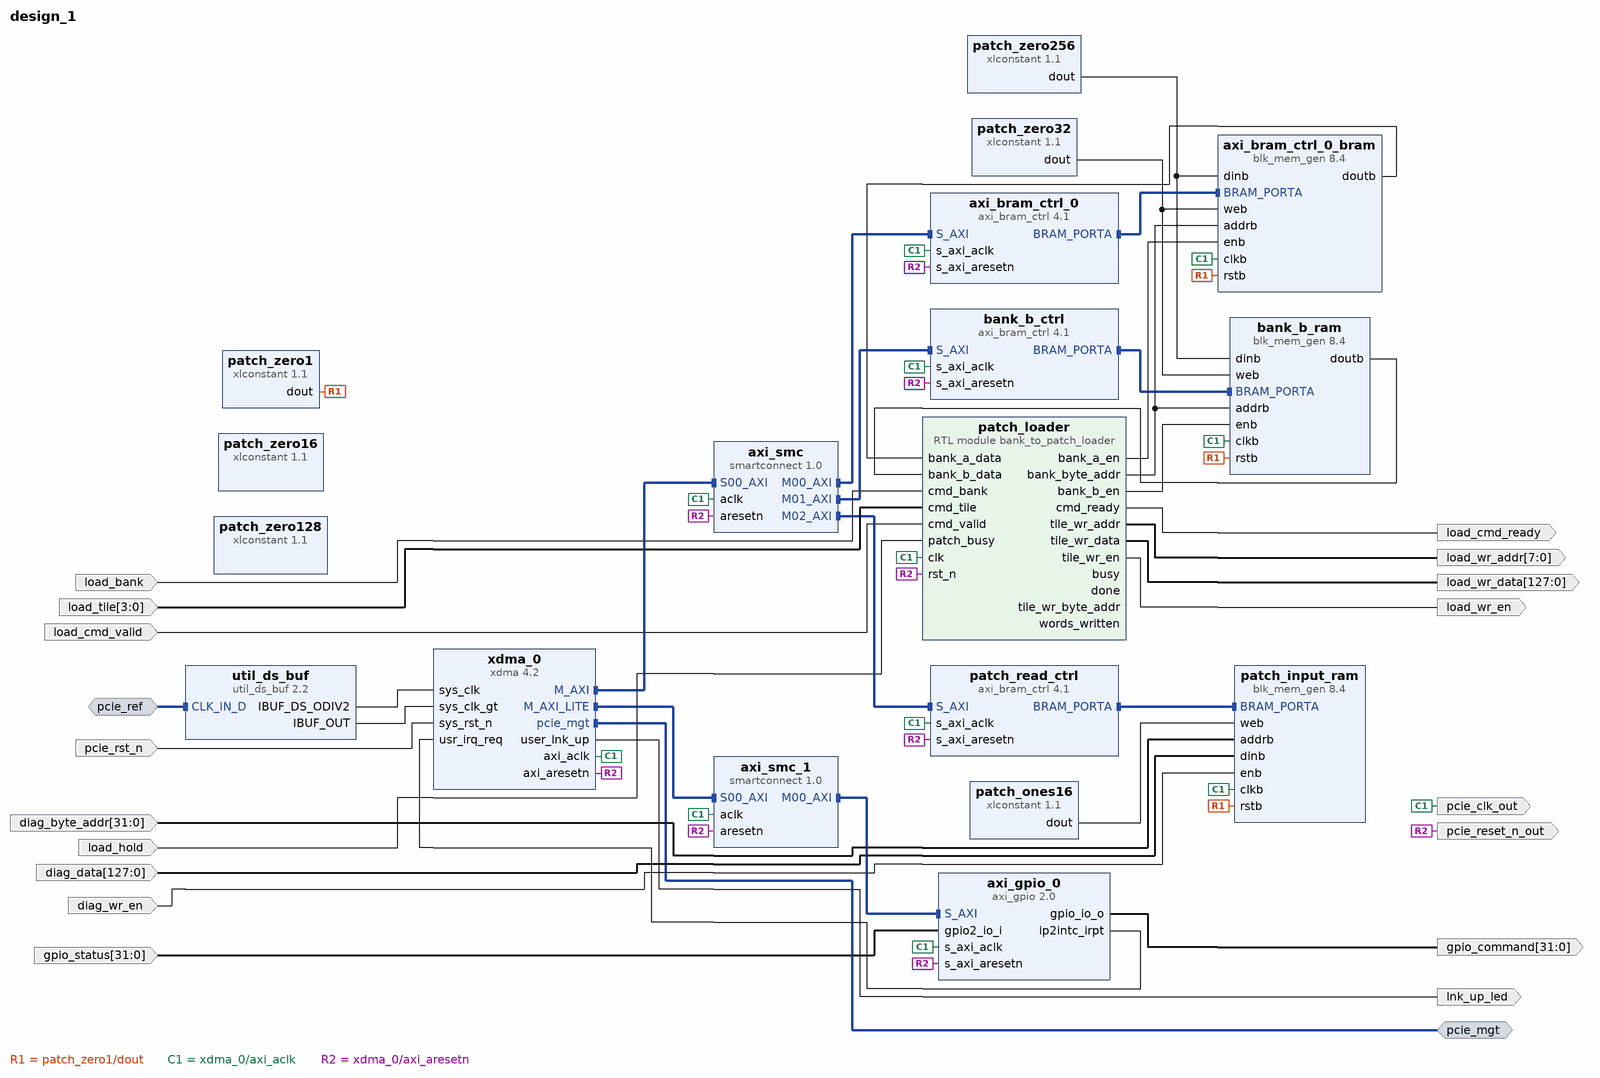
[diagram p0: block diagram of the top level]
# Vivado block design design_1, xcku060-ffva1156-2-i, Vivado 2025.2
create_bd_design design_1

create_bd_intf_port -mode Master -vlnv xilinx.com:interface:pcie_7x_mgt_rtl:1.0 pcie_mgt
create_bd_intf_port -mode Slave -vlnv xilinx.com:interface:diff_clock_rtl:1.0 pcie_ref
set_property -dict {CONFIG.FREQ_HZ 100000000} [get_bd_intf_ports pcie_ref]
create_bd_port -dir I -type rst pcie_rst_n
set_property -dict {CONFIG.POLARITY ACTIVE_LOW} [get_bd_ports pcie_rst_n]
create_bd_port -dir O lnk_up_led
create_bd_port -dir O pcie_clk_out
create_bd_port -dir O pcie_reset_n_out
create_bd_port -dir O -from 31 -to 0 gpio_command
create_bd_port -dir I -from 31 -to 0 gpio_status
create_bd_port -dir I load_cmd_valid
create_bd_port -dir O load_cmd_ready
create_bd_port -dir I load_bank
create_bd_port -dir I -from 3 -to 0 load_tile
create_bd_port -dir I load_hold
create_bd_port -dir O load_wr_en
create_bd_port -dir O -from 7 -to 0 load_wr_addr
create_bd_port -dir O -from 127 -to 0 load_wr_data
create_bd_port -dir I -from 31 -to 0 diag_byte_addr
create_bd_port -dir I -from 127 -to 0 diag_data
create_bd_port -dir I diag_wr_en

create_bd_cell -type ip -vlnv xilinx.com:ip:xdma:4.2 xdma_0
set_property -dict [list \
  CONFIG.PF0_DEVICE_ID_mqdma 9038 \
  CONFIG.PF0_SRIOV_VF_DEVICE_ID A038 \
  CONFIG.PF2_DEVICE_ID_mqdma 9238 \
  CONFIG.PF3_DEVICE_ID_mqdma 9338 \
  CONFIG.axi_data_width 256_bit \
  CONFIG.axilite_master_en true \
  CONFIG.axisten_freq 250 \
  CONFIG.cfg_mgmt_if false \
  CONFIG.pciebar2axibar_axil_master 0x40000000 \
  CONFIG.pf0_device_id 8038 \
  CONFIG.pf0_interrupt_pin NONE \
  CONFIG.pf0_msix_cap_pba_bir BAR_3:2 \
  CONFIG.pf0_msix_cap_pba_offset 00008FE0 \
  CONFIG.pf0_msix_cap_table_bir BAR_3:2 \
  CONFIG.pf0_msix_cap_table_offset 00008000 \
  CONFIG.pf0_msix_cap_table_size 01F \
  CONFIG.pf0_msix_enabled true \
  CONFIG.pl_link_cap_max_link_speed 8.0_GT/s \
  CONFIG.pl_link_cap_max_link_width X8 \
  CONFIG.plltype QPLL1 \
  CONFIG.xdma_axi_intf_mm AXI_Memory_Mapped \
  CONFIG.xdma_pcie_64bit_en true \
  CONFIG.xdma_rnum_chnl 1 \
  CONFIG.xdma_wnum_chnl 1 \
] [get_bd_cells xdma_0]
create_bd_cell -type ip -vlnv xilinx.com:ip:util_ds_buf:2.2 util_ds_buf
set_property -dict {CONFIG.C_BUF_TYPE IBUFDSGTE} [get_bd_cells util_ds_buf]
create_bd_cell -type ip -vlnv xilinx.com:ip:axi_bram_ctrl:4.1 axi_bram_ctrl_0
set_property -dict {CONFIG.DATA_WIDTH 256 CONFIG.SINGLE_PORT_BRAM 1} [get_bd_cells axi_bram_ctrl_0]
create_bd_cell -type ip -vlnv xilinx.com:ip:axi_gpio:2.0 axi_gpio_0
set_property -dict [list \
  CONFIG.C_ALL_INPUTS_2 1 \
  CONFIG.C_ALL_OUTPUTS 1 \
  CONFIG.C_GPIO2_WIDTH 32 \
  CONFIG.C_GPIO_WIDTH 32 \
  CONFIG.C_INTERRUPT_PRESENT 1 \
  CONFIG.C_IS_DUAL 1 \
] [get_bd_cells axi_gpio_0]
create_bd_cell -type ip -vlnv xilinx.com:ip:blk_mem_gen:8.4 axi_bram_ctrl_0_bram
set_property -dict [list \
  CONFIG.EN_SAFETY_CKT false \
  CONFIG.Enable_32bit_Address true \
  CONFIG.Enable_B Use_ENB_Pin \
  CONFIG.Memory_Type True_Dual_Port_RAM \
  CONFIG.Port_B_Clock 100 \
  CONFIG.Port_B_Enable_Rate 100 \
  CONFIG.Port_B_Write_Rate 50 \
  CONFIG.Read_Width_A 256 \
  CONFIG.Read_Width_B 256 \
  CONFIG.Use_RSTB_Pin true \
  CONFIG.Write_Width_A 256 \
  CONFIG.Write_Width_B 256 \
] [get_bd_cells axi_bram_ctrl_0_bram]
create_bd_cell -type ip -vlnv xilinx.com:ip:smartconnect:1.0 axi_smc
set_property -dict {CONFIG.NUM_MI 3 CONFIG.NUM_SI 1} [get_bd_cells axi_smc]
create_bd_cell -type ip -vlnv xilinx.com:ip:smartconnect:1.0 axi_smc_1
set_property -dict {CONFIG.NUM_SI 1} [get_bd_cells axi_smc_1]
create_bd_cell -type ip -vlnv xilinx.com:ip:axi_bram_ctrl:4.1 bank_b_ctrl
set_property -dict {CONFIG.DATA_WIDTH 256 CONFIG.SINGLE_PORT_BRAM 1} [get_bd_cells bank_b_ctrl]
create_bd_cell -type ip -vlnv xilinx.com:ip:blk_mem_gen:8.4 bank_b_ram
set_property -dict [list \
  CONFIG.EN_SAFETY_CKT false \
  CONFIG.Enable_32bit_Address true \
  CONFIG.Enable_B Use_ENB_Pin \
  CONFIG.Memory_Type True_Dual_Port_RAM \
  CONFIG.Read_Width_A 256 \
  CONFIG.Read_Width_B 256 \
  CONFIG.Use_RSTB_Pin true \
  CONFIG.Write_Width_A 256 \
  CONFIG.Write_Width_B 256 \
] [get_bd_cells bank_b_ram]
create_bd_cell -type module -reference bank_to_patch_loader patch_loader
create_bd_cell -type ip -vlnv xilinx.com:ip:axi_bram_ctrl:4.1 patch_read_ctrl
set_property -dict {CONFIG.DATA_WIDTH 128 CONFIG.SINGLE_PORT_BRAM 1} [get_bd_cells patch_read_ctrl]
create_bd_cell -type ip -vlnv xilinx.com:ip:blk_mem_gen:8.4 patch_input_ram
set_property -dict [list \
  CONFIG.Enable_32bit_Address true \
  CONFIG.Enable_B Use_ENB_Pin \
  CONFIG.Memory_Type True_Dual_Port_RAM \
  CONFIG.Read_Width_A 128 \
  CONFIG.Read_Width_B 128 \
  CONFIG.Use_RSTB_Pin true \
  CONFIG.Write_Width_A 128 \
  CONFIG.Write_Width_B 128 \
] [get_bd_cells patch_input_ram]
create_bd_cell -type ip -vlnv xilinx.com:ip:xlconstant:1.1 patch_zero1
set_property -dict {CONFIG.CONST_VAL 0 CONFIG.CONST_WIDTH 1} [get_bd_cells patch_zero1]
create_bd_cell -type ip -vlnv xilinx.com:ip:xlconstant:1.1 patch_zero16
set_property -dict {CONFIG.CONST_VAL 0 CONFIG.CONST_WIDTH 16} [get_bd_cells patch_zero16]
create_bd_cell -type ip -vlnv xilinx.com:ip:xlconstant:1.1 patch_ones16
set_property -dict {CONFIG.CONST_VAL 65535 CONFIG.CONST_WIDTH 16} [get_bd_cells patch_ones16]
create_bd_cell -type ip -vlnv xilinx.com:ip:xlconstant:1.1 patch_zero128
set_property -dict {CONFIG.CONST_VAL 0 CONFIG.CONST_WIDTH 128} [get_bd_cells patch_zero128]
create_bd_cell -type ip -vlnv xilinx.com:ip:xlconstant:1.1 patch_zero256
set_property -dict {CONFIG.CONST_VAL 0 CONFIG.CONST_WIDTH 256} [get_bd_cells patch_zero256]
create_bd_cell -type ip -vlnv xilinx.com:ip:xlconstant:1.1 patch_zero32
set_property -dict {CONFIG.CONST_VAL 0 CONFIG.CONST_WIDTH 32} [get_bd_cells patch_zero32]

# ---- connections ----

connect_bd_intf_net [get_bd_intf_pins axi_bram_ctrl_0_bram/BRAM_PORTA] [get_bd_intf_pins axi_bram_ctrl_0/BRAM_PORTA]
connect_bd_intf_net [get_bd_intf_pins axi_smc_1/M00_AXI] [get_bd_intf_pins axi_gpio_0/S_AXI]
connect_bd_intf_net [get_bd_intf_pins axi_smc/M00_AXI] [get_bd_intf_pins axi_bram_ctrl_0/S_AXI]
connect_bd_intf_net [get_bd_intf_pins axi_smc/M01_AXI] [get_bd_intf_pins bank_b_ctrl/S_AXI]
connect_bd_intf_net [get_bd_intf_pins axi_smc/M02_AXI] [get_bd_intf_pins patch_read_ctrl/S_AXI]
connect_bd_intf_net [get_bd_intf_pins bank_b_ctrl/BRAM_PORTA] [get_bd_intf_pins bank_b_ram/BRAM_PORTA]
connect_bd_intf_net -intf_net diff_clock_rtl_0_1 [get_bd_intf_ports pcie_ref] [get_bd_intf_pins util_ds_buf/CLK_IN_D]
connect_bd_intf_net [get_bd_intf_pins patch_read_ctrl/BRAM_PORTA] [get_bd_intf_pins patch_input_ram/BRAM_PORTA]
connect_bd_intf_net [get_bd_intf_pins xdma_0/M_AXI] [get_bd_intf_pins axi_smc/S00_AXI]
connect_bd_intf_net [get_bd_intf_pins xdma_0/M_AXI_LITE] [get_bd_intf_pins axi_smc_1/S00_AXI]
connect_bd_intf_net [get_bd_intf_ports pcie_mgt] [get_bd_intf_pins xdma_0/pcie_mgt]
connect_bd_net [get_bd_pins axi_bram_ctrl_0_bram/doutb] [get_bd_pins patch_loader/bank_a_data]
connect_bd_net [get_bd_pins axi_gpio_0/gpio_io_o] [get_bd_ports gpio_command]
connect_bd_net [get_bd_pins axi_gpio_0/ip2intc_irpt] [get_bd_pins xdma_0/usr_irq_req]
connect_bd_net [get_bd_pins bank_b_ram/doutb] [get_bd_pins patch_loader/bank_b_data]
connect_bd_net [get_bd_ports diag_byte_addr] [get_bd_pins patch_input_ram/addrb]
connect_bd_net [get_bd_ports diag_data] [get_bd_pins patch_input_ram/dinb]
connect_bd_net [get_bd_ports diag_wr_en] [get_bd_pins patch_input_ram/enb]
connect_bd_net -net patch_gpio_cmd_bank [get_bd_ports load_bank] [get_bd_pins patch_loader/cmd_bank]
connect_bd_net -net patch_gpio_cmd_tile [get_bd_ports load_tile] [get_bd_pins patch_loader/cmd_tile]
connect_bd_net -net patch_gpio_cmd_valid [get_bd_ports load_cmd_valid] [get_bd_pins patch_loader/cmd_valid]
connect_bd_net -net patch_gpio_gpio_status [get_bd_ports gpio_status] [get_bd_pins axi_gpio_0/gpio2_io_i]
connect_bd_net -net patch_gpio_patch_busy [get_bd_ports load_hold] [get_bd_pins patch_loader/patch_busy]
connect_bd_net [get_bd_pins patch_loader/bank_a_en] [get_bd_pins axi_bram_ctrl_0_bram/enb]
connect_bd_net [get_bd_pins patch_loader/bank_b_en] [get_bd_pins bank_b_ram/enb]
connect_bd_net [get_bd_pins patch_loader/bank_byte_addr] [get_bd_pins axi_bram_ctrl_0_bram/addrb] [get_bd_pins bank_b_ram/addrb]
# net patch_loader_busy has one end: patch_loader/busy
connect_bd_net [get_bd_pins patch_loader/cmd_ready] [get_bd_ports load_cmd_ready]
# net patch_loader_done has one end: patch_loader/done
connect_bd_net [get_bd_pins patch_loader/tile_wr_addr] [get_bd_ports load_wr_addr]
# net patch_loader_tile_wr_byte_addr has one end: patch_loader/tile_wr_byte_addr
connect_bd_net [get_bd_pins patch_loader/tile_wr_data] [get_bd_ports load_wr_data]
connect_bd_net [get_bd_pins patch_loader/tile_wr_en] [get_bd_ports load_wr_en]
# net patch_loader_words_written has one end: patch_loader/words_written
connect_bd_net [get_bd_pins patch_ones16/dout] [get_bd_pins patch_input_ram/web]
connect_bd_net [get_bd_pins patch_zero1/dout] [get_bd_pins axi_bram_ctrl_0_bram/rstb] [get_bd_pins bank_b_ram/rstb] [get_bd_pins patch_input_ram/rstb]
connect_bd_net [get_bd_pins patch_zero256/dout] [get_bd_pins axi_bram_ctrl_0_bram/dinb] [get_bd_pins bank_b_ram/dinb]
connect_bd_net [get_bd_pins patch_zero32/dout] [get_bd_pins axi_bram_ctrl_0_bram/web] [get_bd_pins bank_b_ram/web]
connect_bd_net -net reset_rtl_0_1 [get_bd_ports pcie_rst_n] [get_bd_pins xdma_0/sys_rst_n]
connect_bd_net [get_bd_pins util_ds_buf/IBUF_DS_ODIV2] [get_bd_pins xdma_0/sys_clk]
connect_bd_net [get_bd_pins util_ds_buf/IBUF_OUT] [get_bd_pins xdma_0/sys_clk_gt]
connect_bd_net [get_bd_pins xdma_0/axi_aclk] \
  [get_bd_pins axi_bram_ctrl_0/s_axi_aclk] [get_bd_pins axi_gpio_0/s_axi_aclk] [get_bd_pins axi_smc/aclk] \
  [get_bd_pins axi_smc_1/aclk] [get_bd_pins bank_b_ctrl/s_axi_aclk] [get_bd_pins patch_loader/clk] \
  [get_bd_pins patch_read_ctrl/s_axi_aclk] [get_bd_pins patch_input_ram/clkb] [get_bd_pins axi_bram_ctrl_0_bram/clkb] \
  [get_bd_pins bank_b_ram/clkb] [get_bd_ports pcie_clk_out]
connect_bd_net [get_bd_pins xdma_0/axi_aresetn] \
  [get_bd_pins axi_bram_ctrl_0/s_axi_aresetn] [get_bd_pins axi_gpio_0/s_axi_aresetn] [get_bd_pins axi_smc/aresetn] \
  [get_bd_pins axi_smc_1/aresetn] [get_bd_pins bank_b_ctrl/s_axi_aresetn] [get_bd_pins patch_loader/rst_n] \
  [get_bd_pins patch_read_ctrl/s_axi_aresetn] [get_bd_ports pcie_reset_n_out]
connect_bd_net [get_bd_pins xdma_0/user_lnk_up] [get_bd_ports lnk_up_led]

# ---- address map ----
assign_bd_address -offset 0x0000000000000000 -range 64K -target_address_space [get_bd_addr_spaces xdma_0/M_AXI] [get_bd_addr_segs axi_bram_ctrl_0/S_AXI/Mem0]
assign_bd_address -offset 0x0000000000010000 -range 64K -target_address_space [get_bd_addr_spaces xdma_0/M_AXI] [get_bd_addr_segs bank_b_ctrl/S_AXI/Mem0]
assign_bd_address -offset 0x0000000000020000 -range 32K -target_address_space [get_bd_addr_spaces xdma_0/M_AXI] [get_bd_addr_segs patch_read_ctrl/S_AXI/Mem0]
assign_bd_address -offset 0x40000000 -range 64K -target_address_space [get_bd_addr_spaces xdma_0/M_AXI_LITE] [get_bd_addr_segs axi_gpio_0/S_AXI/Reg]

validate_bd_design
save_bd_design
